# Altium schematic sheet SCH_0_Global Connections.SchDoc
size A
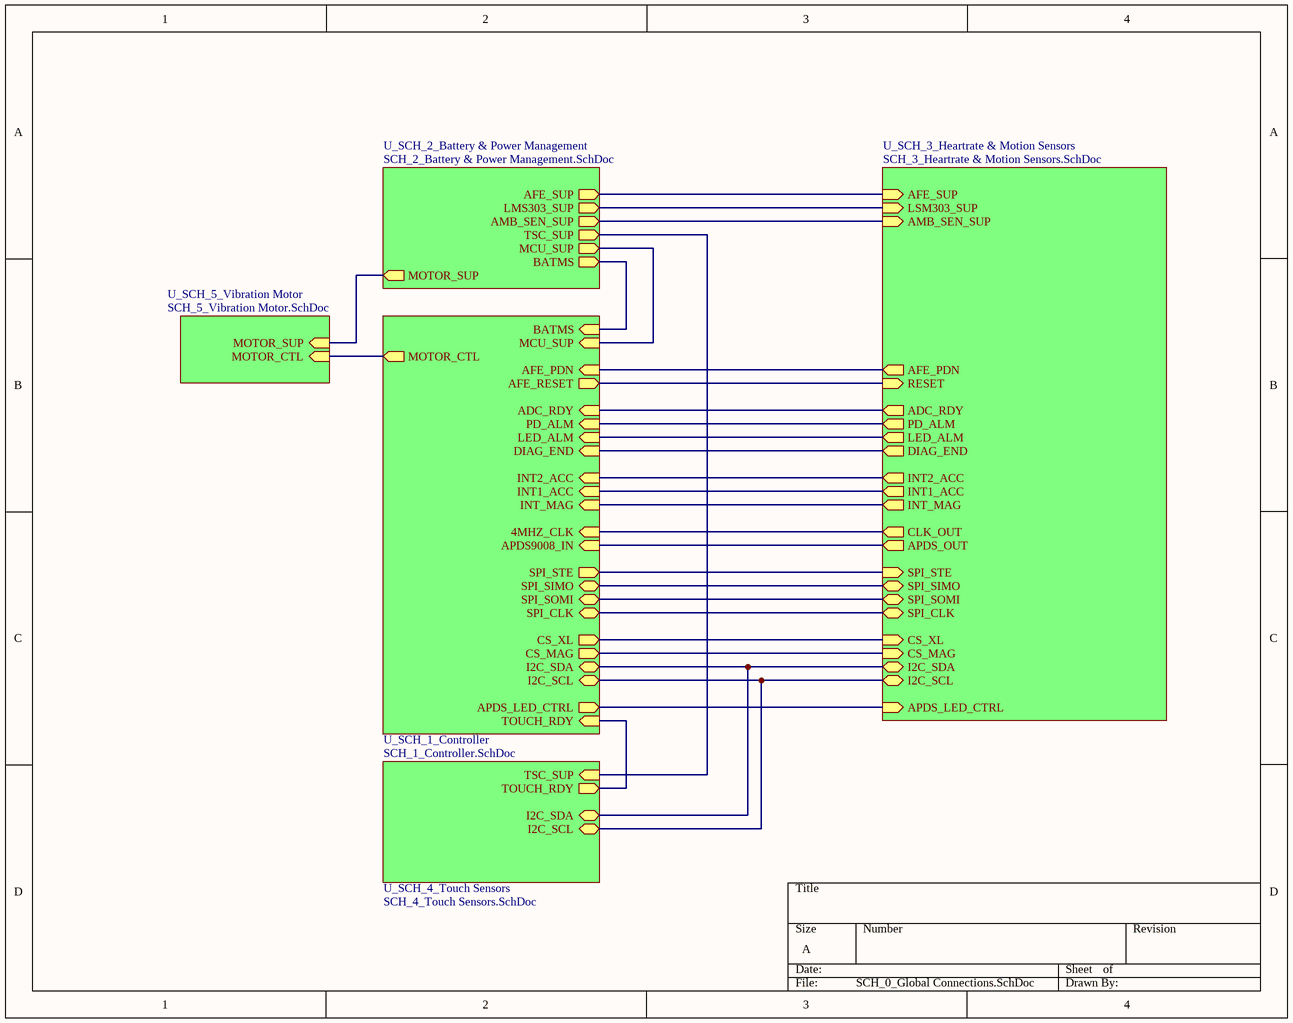
[diagram p0: SCH_0_Global Connections.SchDoc]

## Sub-sheets
U_SCH_1_Controller = SCH_1_Controller.SchDoc: MCU_SUP (in), ADC_RDY (in), PD_ALM (in), LED_ALM (in), DIAG_END (in), AFE_RESET (out), INT_MAG (in), INT2_ACC (in), INT1_ACC (in), 4MHZ_CLK (in), APDS9008_IN (in), SPI_STE (out), SPI_SIMO (bidir), SPI_SOMI (bidir), SPI_CLK (bidir), CS_XL (out), CS_MAG (out), I2C_SDA (bidir), I2C_SCL (bidir), BATMS (in), TOUCH_RDY (in), APDS_LED_CTRL (out), AFE_PDN (in), MOTOR_CTL (out)
U_SCH_2_Battery & Power Management = SCH_2_Battery & Power Management.SchDoc: LMS303_SUP (out), AMB_SEN_SUP (out), MCU_SUP (out), BATMS (out), AFE_SUP (out), MOTOR_SUP (out), TSC_SUP (out)
U_SCH_3_Heartrate & Motion Sensors = SCH_3_Heartrate & Motion Sensors.SchDoc: CLK_OUT (out), RESET (in), ADC_RDY (out), SPI_STE (in), SPI_SIMO (bidir), SPI_SOMI (bidir), SPI_CLK (bidir), PD_ALM (out), LED_ALM (out), DIAG_END (out), INT_MAG (out), INT2_ACC (out), INT1_ACC (out), CS_XL (in), CS_MAG (in), I2C_SDA (bidir), I2C_SCL (bidir), APDS_OUT (out), LSM303_SUP (in), AMB_SEN_SUP (in), AFE_SUP (in), APDS_LED_CTRL (in), AFE_PDN (out)
U_SCH_4_Touch Sensors = SCH_4_Touch Sensors.SchDoc: TOUCH_RDY (out), I2C_SDA (bidir), I2C_SCL (bidir), TSC_SUP (in)
U_SCH_5_Vibration Motor = SCH_5_Vibration Motor.SchDoc: MOTOR_CTL (in), MOTOR_SUP (in)

## Nets
(unnamed): sheet U_SCH_3_Heartrate & Motion Sensors/CLK_OUT, sheet U_SCH_1_Controller/4MHZ_CLK
(unnamed): sheet U_SCH_3_Heartrate & Motion Sensors/RESET, sheet U_SCH_1_Controller/AFE_RESET
(unnamed): sheet U_SCH_3_Heartrate & Motion Sensors/ADC_RDY, sheet U_SCH_1_Controller/ADC_RDY
(unnamed): sheet U_SCH_3_Heartrate & Motion Sensors/SPI_STE, sheet U_SCH_1_Controller/SPI_STE
(unnamed): sheet U_SCH_3_Heartrate & Motion Sensors/SPI_SIMO, sheet U_SCH_1_Controller/SPI_SIMO
(unnamed): sheet U_SCH_3_Heartrate & Motion Sensors/SPI_SOMI, sheet U_SCH_1_Controller/SPI_SOMI
(unnamed): sheet U_SCH_3_Heartrate & Motion Sensors/SPI_CLK, sheet U_SCH_1_Controller/SPI_CLK
(unnamed): sheet U_SCH_3_Heartrate & Motion Sensors/PD_ALM, sheet U_SCH_1_Controller/PD_ALM
(unnamed): sheet U_SCH_3_Heartrate & Motion Sensors/LED_ALM, sheet U_SCH_1_Controller/LED_ALM
(unnamed): sheet U_SCH_3_Heartrate & Motion Sensors/DIAG_END, sheet U_SCH_1_Controller/DIAG_END
(unnamed): sheet U_SCH_3_Heartrate & Motion Sensors/INT_MAG, sheet U_SCH_1_Controller/INT_MAG
(unnamed): sheet U_SCH_3_Heartrate & Motion Sensors/INT2_ACC, sheet U_SCH_1_Controller/INT2_ACC
(unnamed): sheet U_SCH_3_Heartrate & Motion Sensors/INT1_ACC, sheet U_SCH_1_Controller/INT1_ACC
(unnamed): sheet U_SCH_3_Heartrate & Motion Sensors/CS_XL, sheet U_SCH_1_Controller/CS_XL
(unnamed): sheet U_SCH_3_Heartrate & Motion Sensors/CS_MAG, sheet U_SCH_1_Controller/CS_MAG
(unnamed): sheet U_SCH_3_Heartrate & Motion Sensors/I2C_SDA, sheet U_SCH_1_Controller/I2C_SDA, sheet U_SCH_4_Touch Sensors/I2C_SDA
(unnamed): sheet U_SCH_3_Heartrate & Motion Sensors/I2C_SCL, sheet U_SCH_1_Controller/I2C_SCL, sheet U_SCH_4_Touch Sensors/I2C_SCL
(unnamed): sheet U_SCH_3_Heartrate & Motion Sensors/APDS_OUT, sheet U_SCH_1_Controller/APDS9008_IN
(unnamed): sheet U_SCH_3_Heartrate & Motion Sensors/LSM303_SUP, sheet U_SCH_2_Battery & Power Management/LMS303_SUP
(unnamed): sheet U_SCH_3_Heartrate & Motion Sensors/AMB_SEN_SUP, sheet U_SCH_2_Battery & Power Management/AMB_SEN_SUP
(unnamed): sheet U_SCH_3_Heartrate & Motion Sensors/AFE_SUP, sheet U_SCH_2_Battery & Power Management/AFE_SUP
(unnamed): sheet U_SCH_3_Heartrate & Motion Sensors/APDS_LED_CTRL, sheet U_SCH_1_Controller/APDS_LED_CTRL
(unnamed): sheet U_SCH_3_Heartrate & Motion Sensors/AFE_PDN, sheet U_SCH_1_Controller/AFE_PDN
(unnamed): sheet U_SCH_2_Battery & Power Management/MCU_SUP, sheet U_SCH_1_Controller/MCU_SUP
(unnamed): sheet U_SCH_2_Battery & Power Management/BATMS, sheet U_SCH_1_Controller/BATMS
(unnamed): sheet U_SCH_2_Battery & Power Management/MOTOR_SUP, sheet U_SCH_5_Vibration Motor/MOTOR_SUP
(unnamed): sheet U_SCH_2_Battery & Power Management/TSC_SUP, sheet U_SCH_4_Touch Sensors/TSC_SUP
(unnamed): sheet U_SCH_1_Controller/TOUCH_RDY, sheet U_SCH_4_Touch Sensors/TOUCH_RDY
(unnamed): sheet U_SCH_1_Controller/MOTOR_CTL, sheet U_SCH_5_Vibration Motor/MOTOR_CTL